# EAGLE schematic all (EAGLE 6.2)
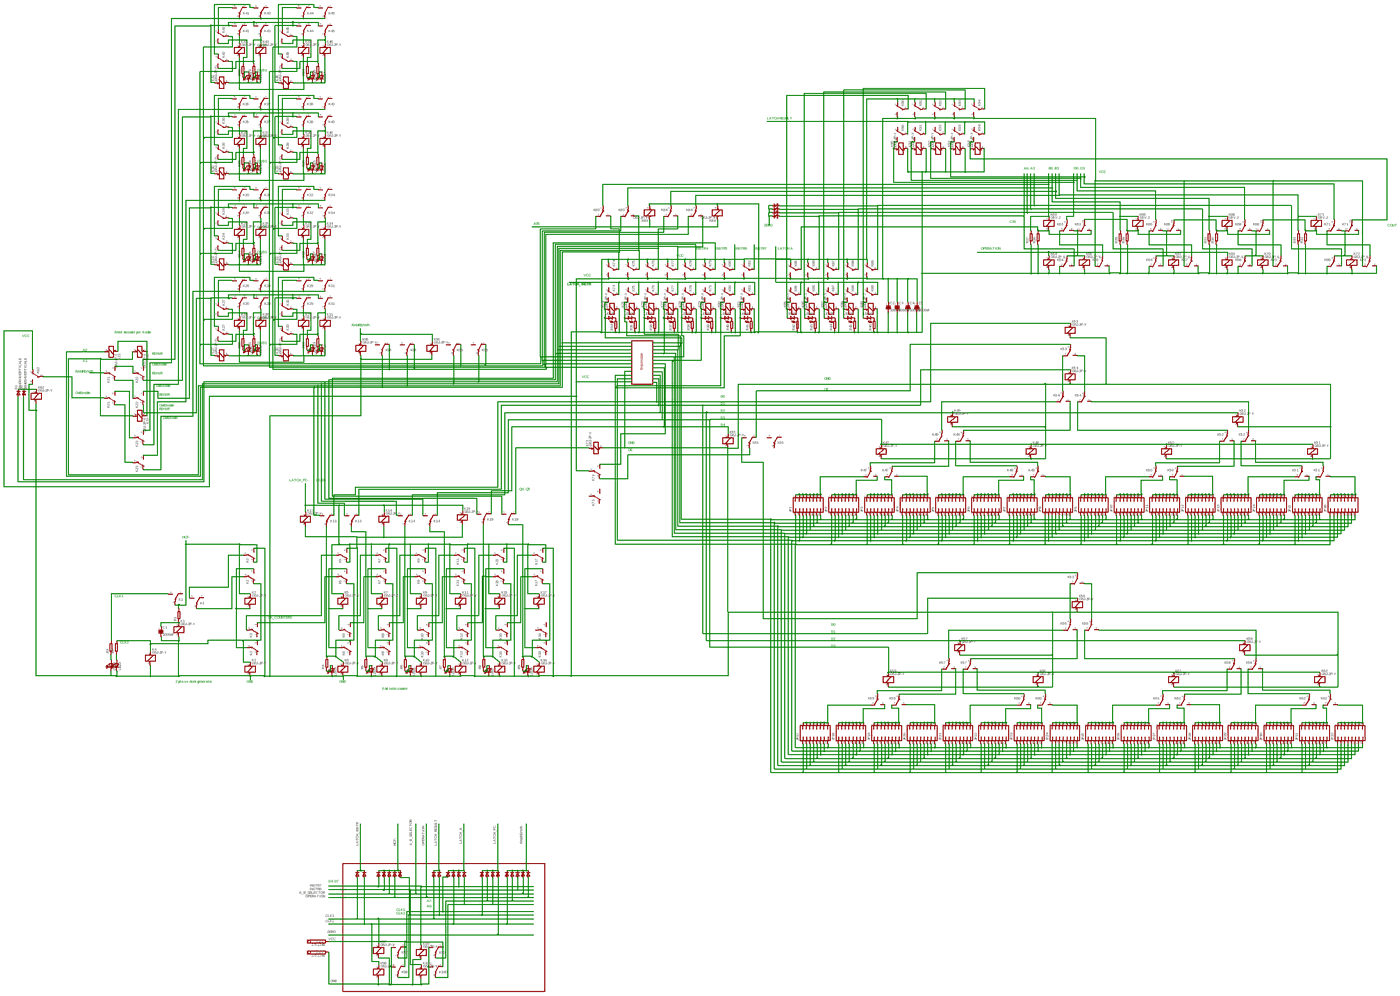
[diagram p0: schematic, sheet 1, overview]
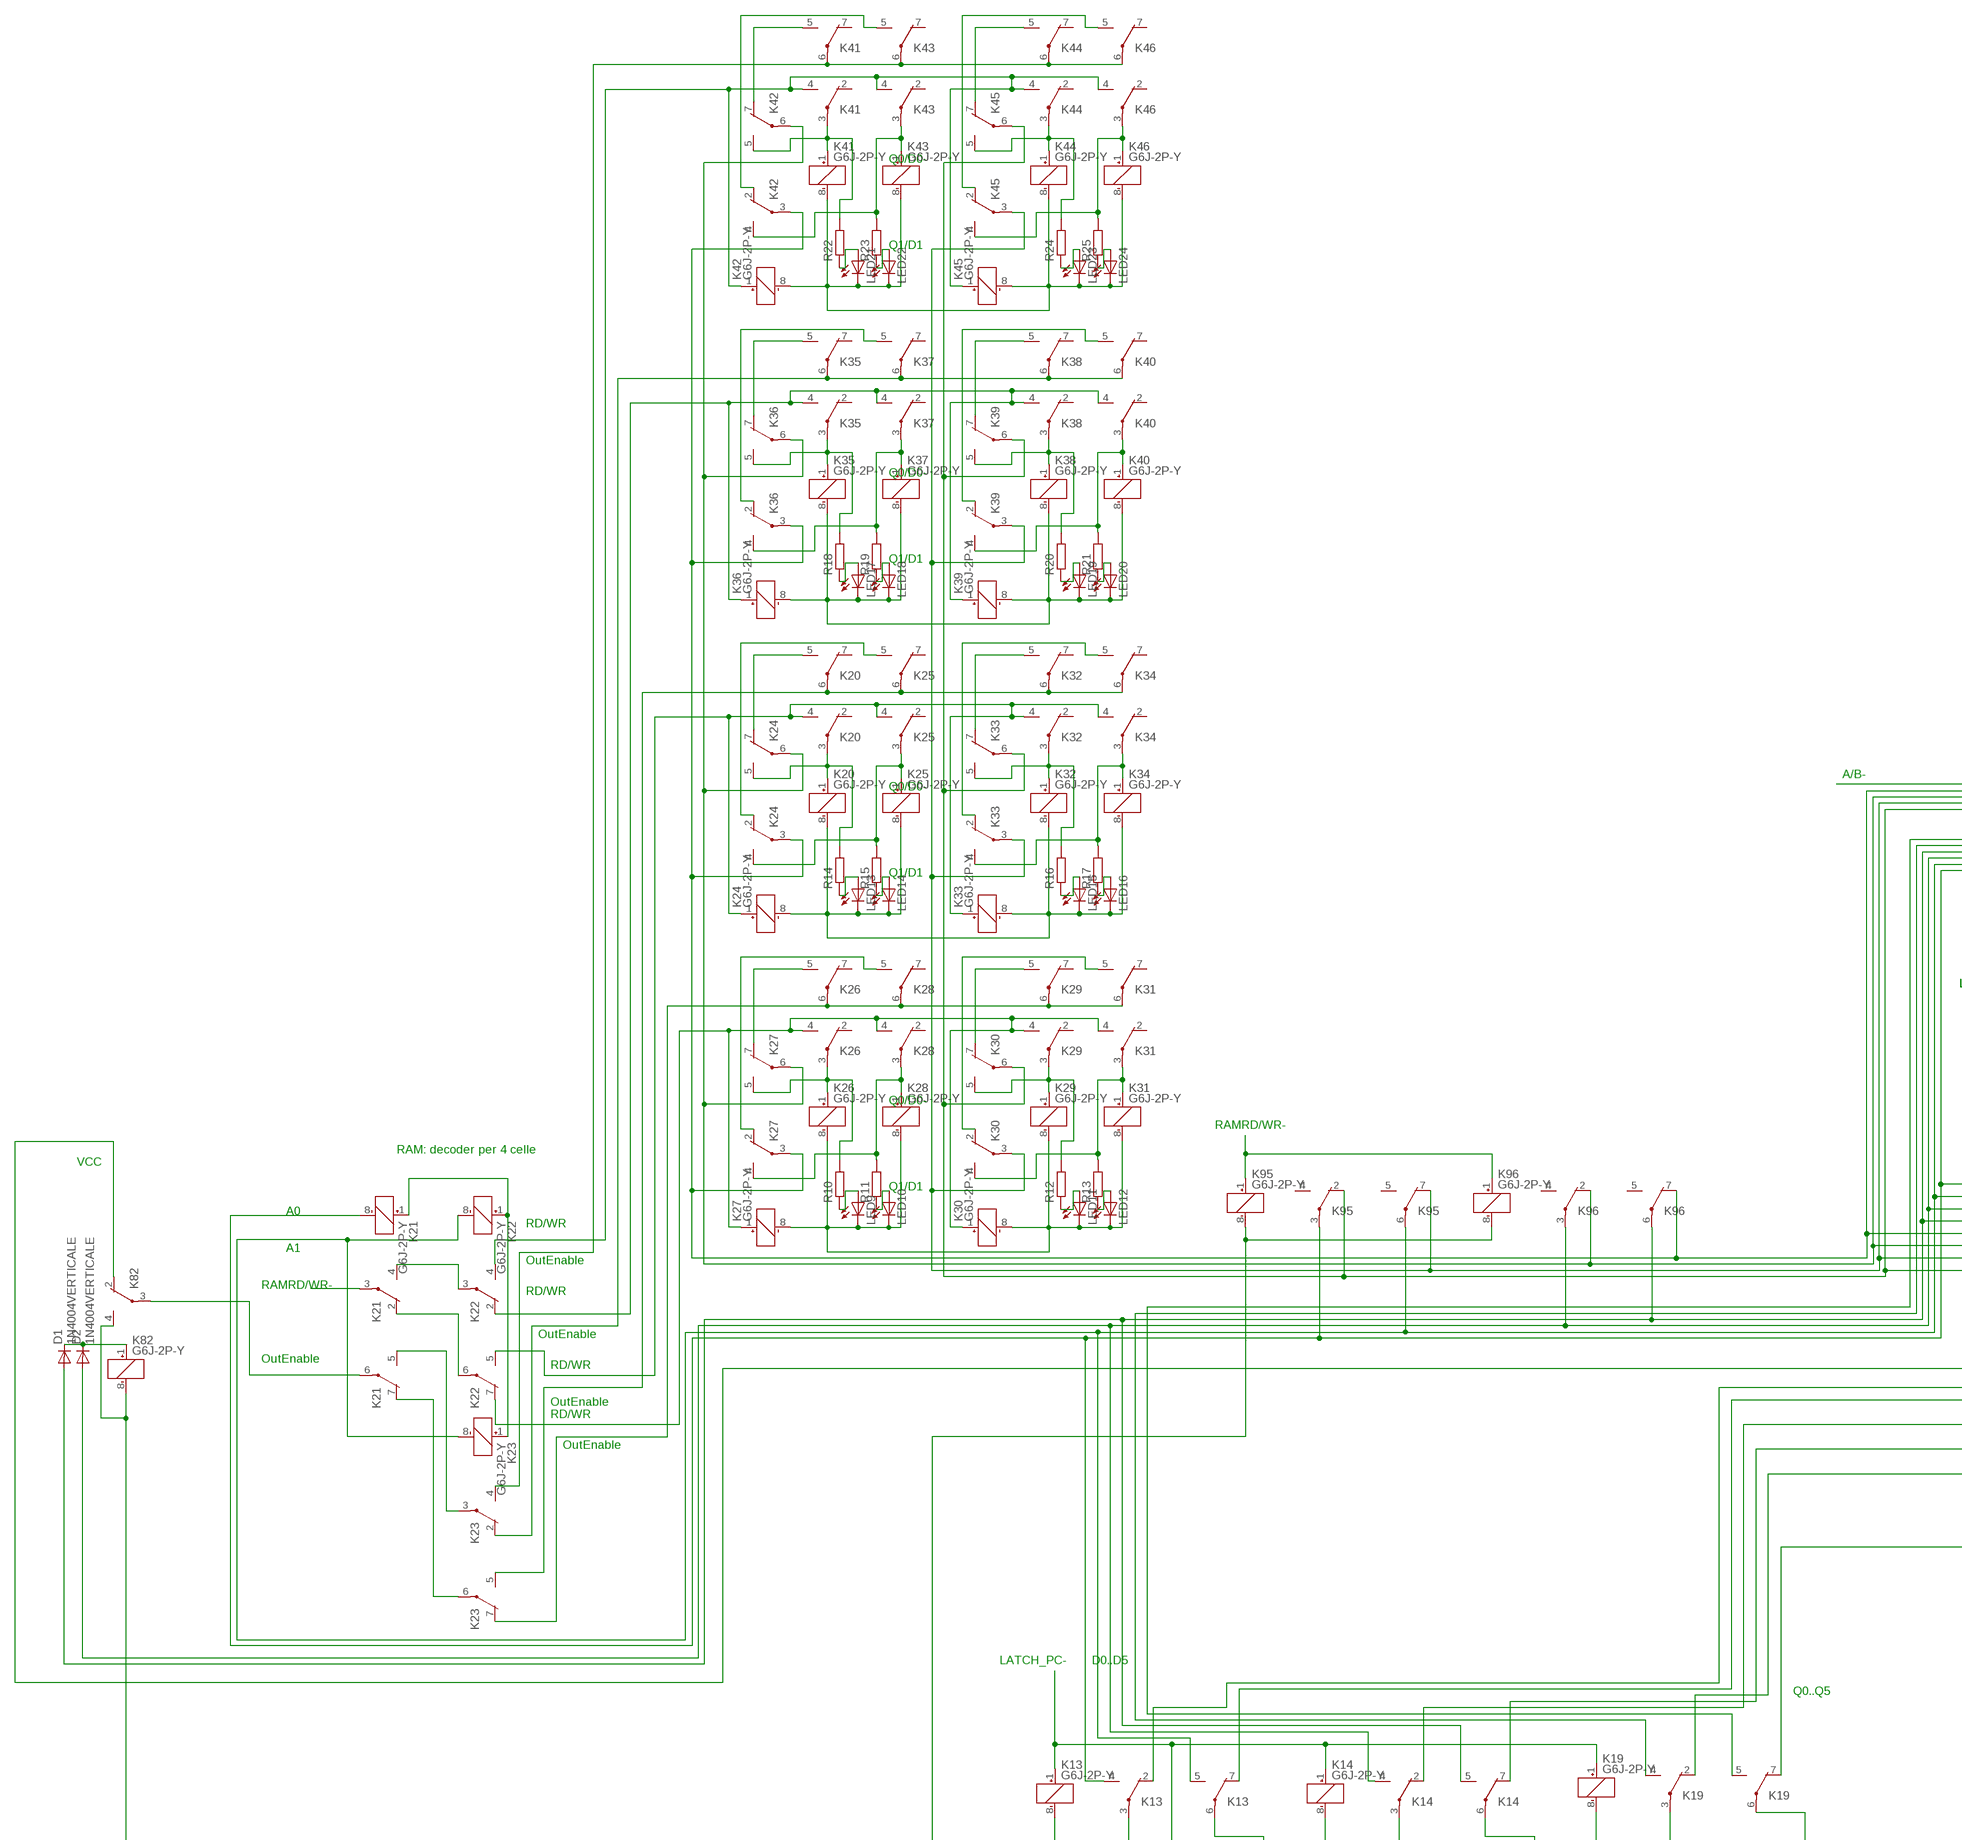
[diagram p1: schematic, sheet 1, part 1 of 5]
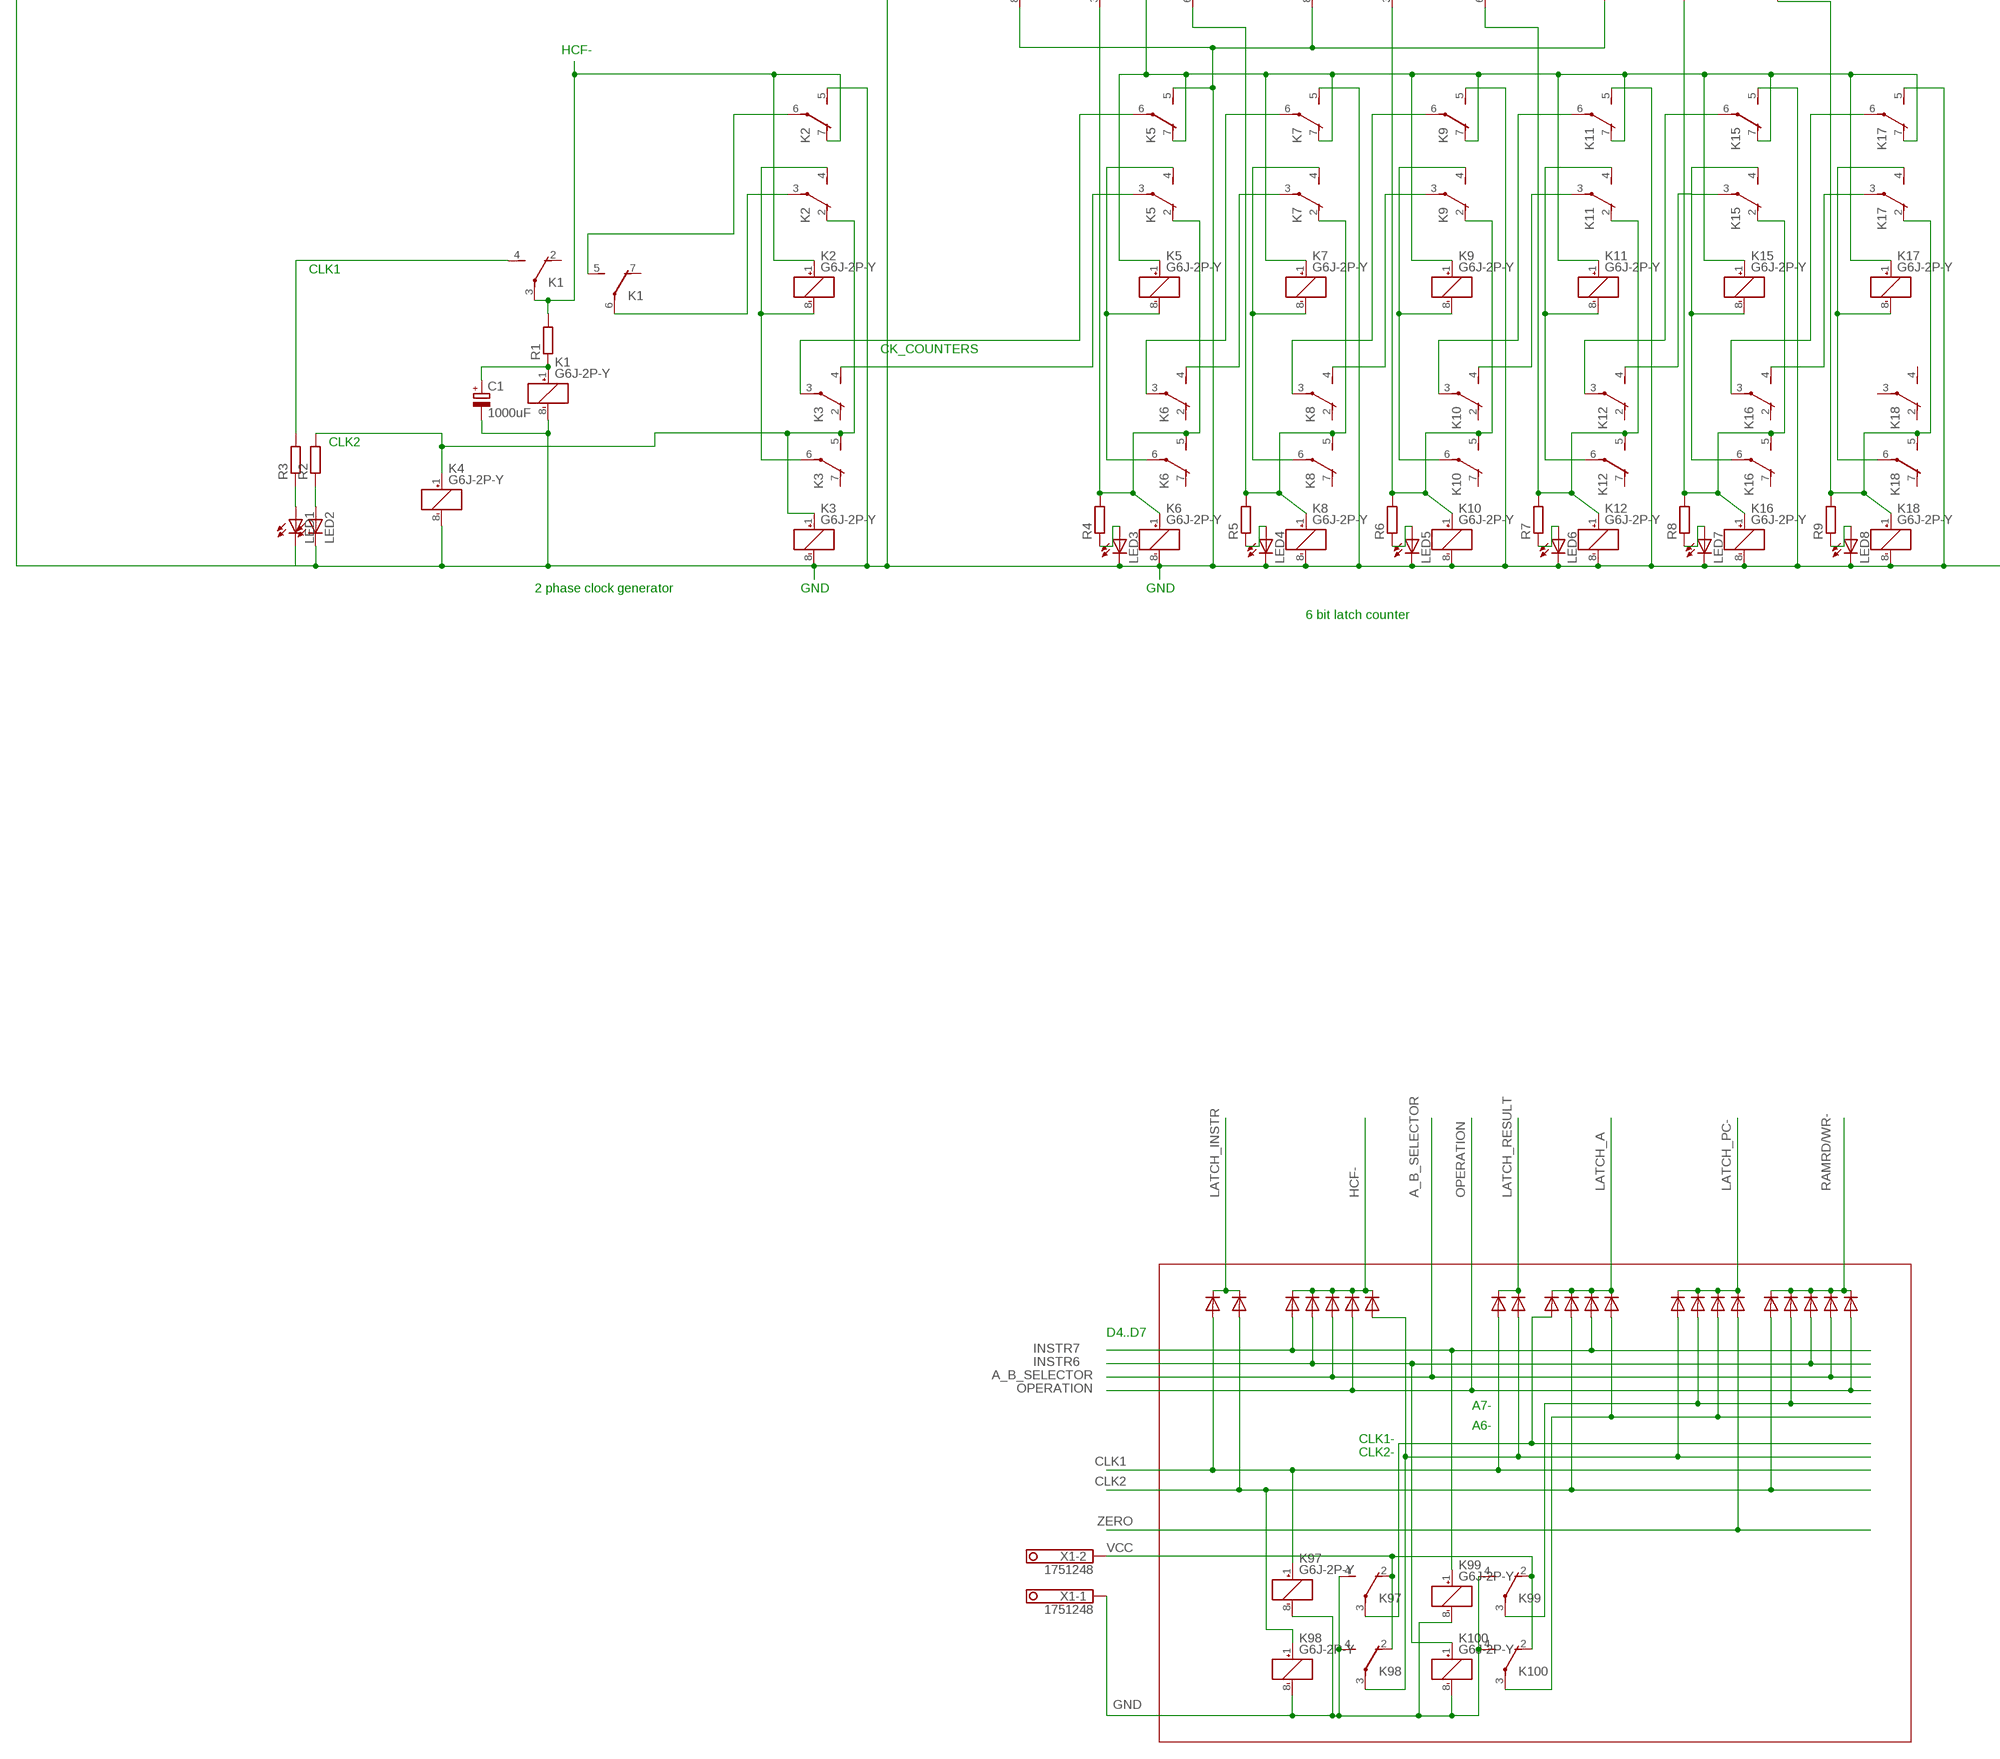
[diagram p2: schematic, sheet 1, part 2 of 5]
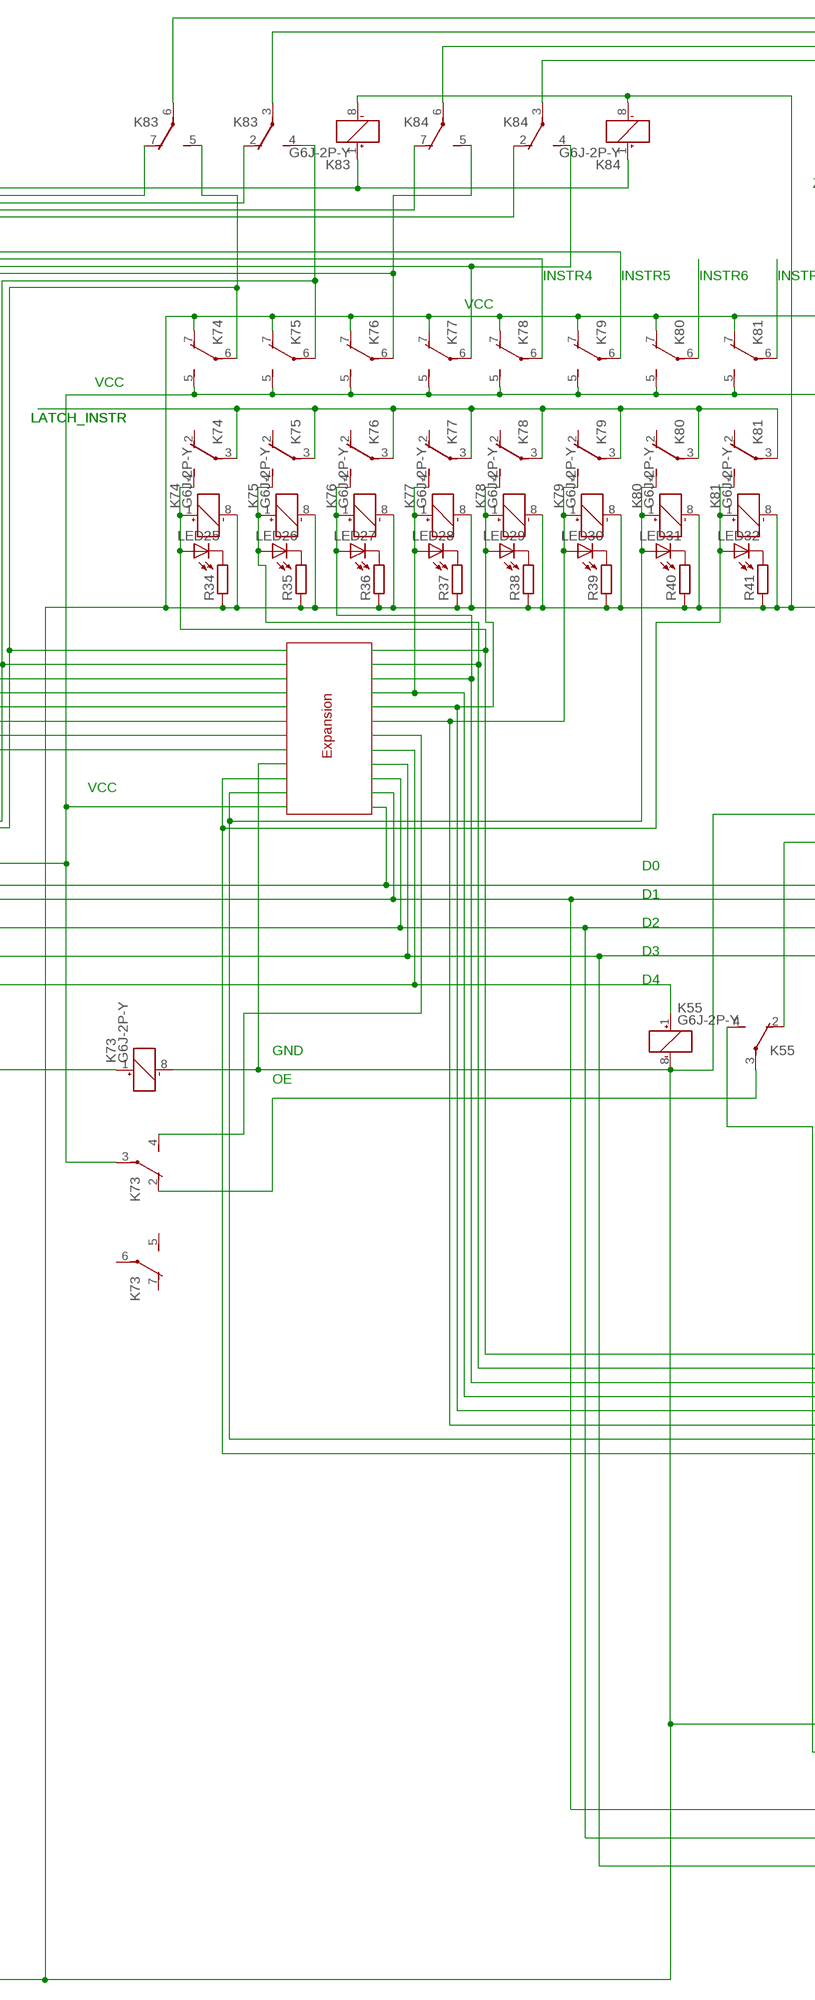
[diagram p3: schematic, sheet 1, part 3 of 5]
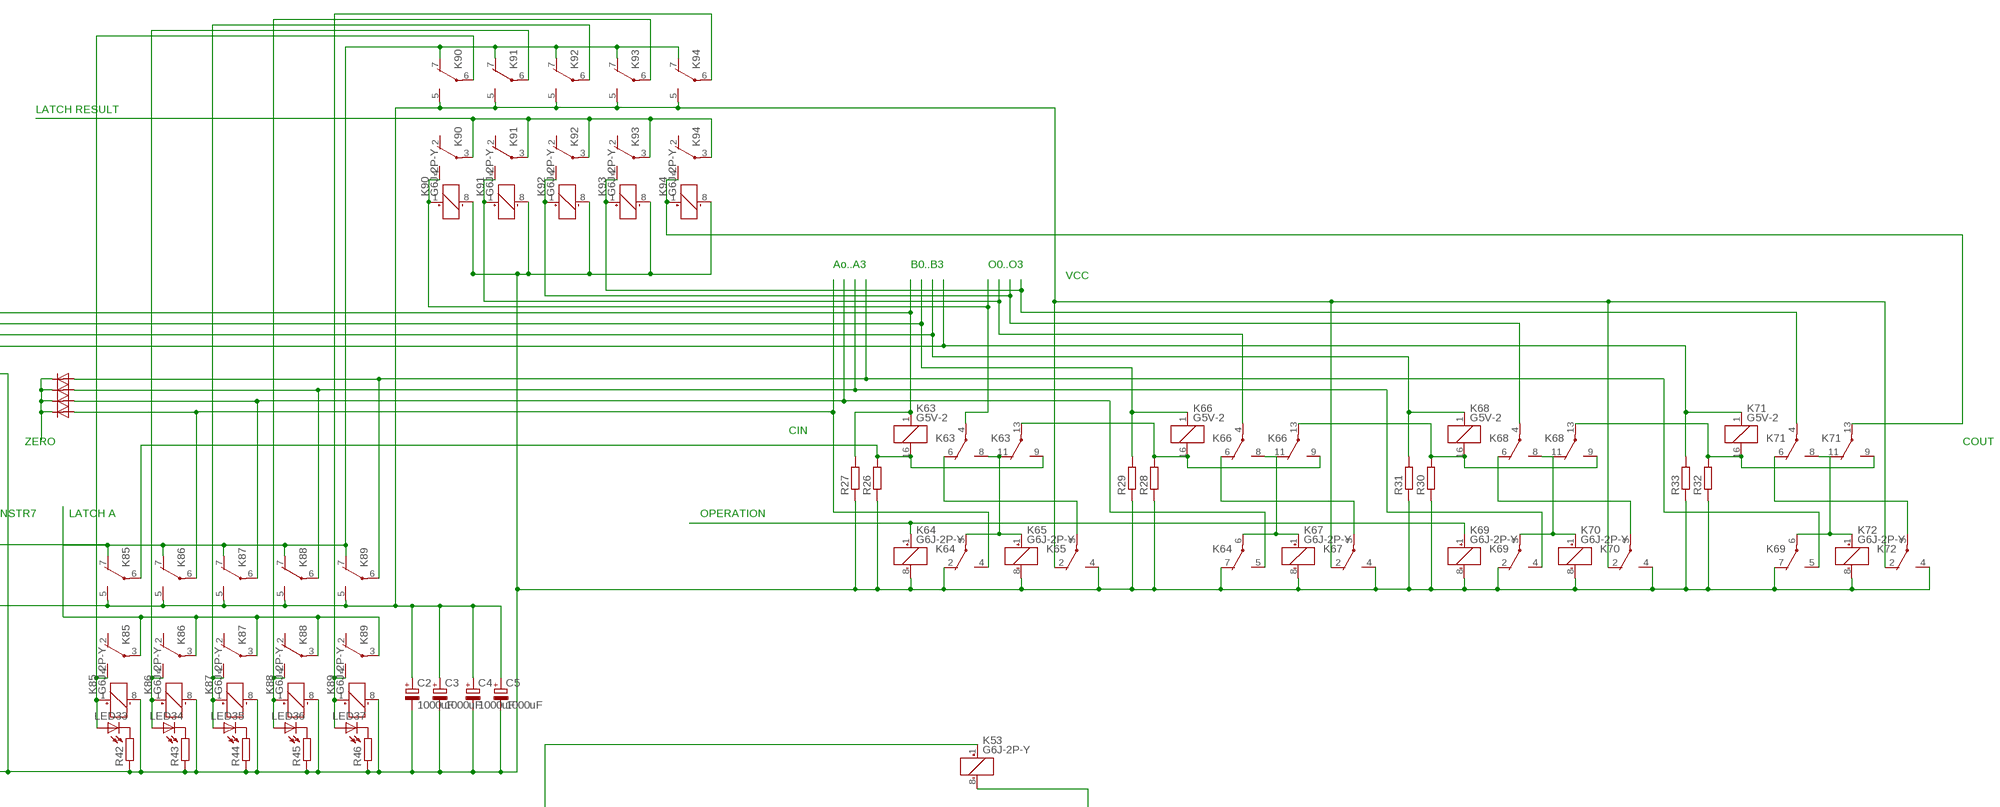
[diagram p4: schematic, sheet 1, part 4 of 5]
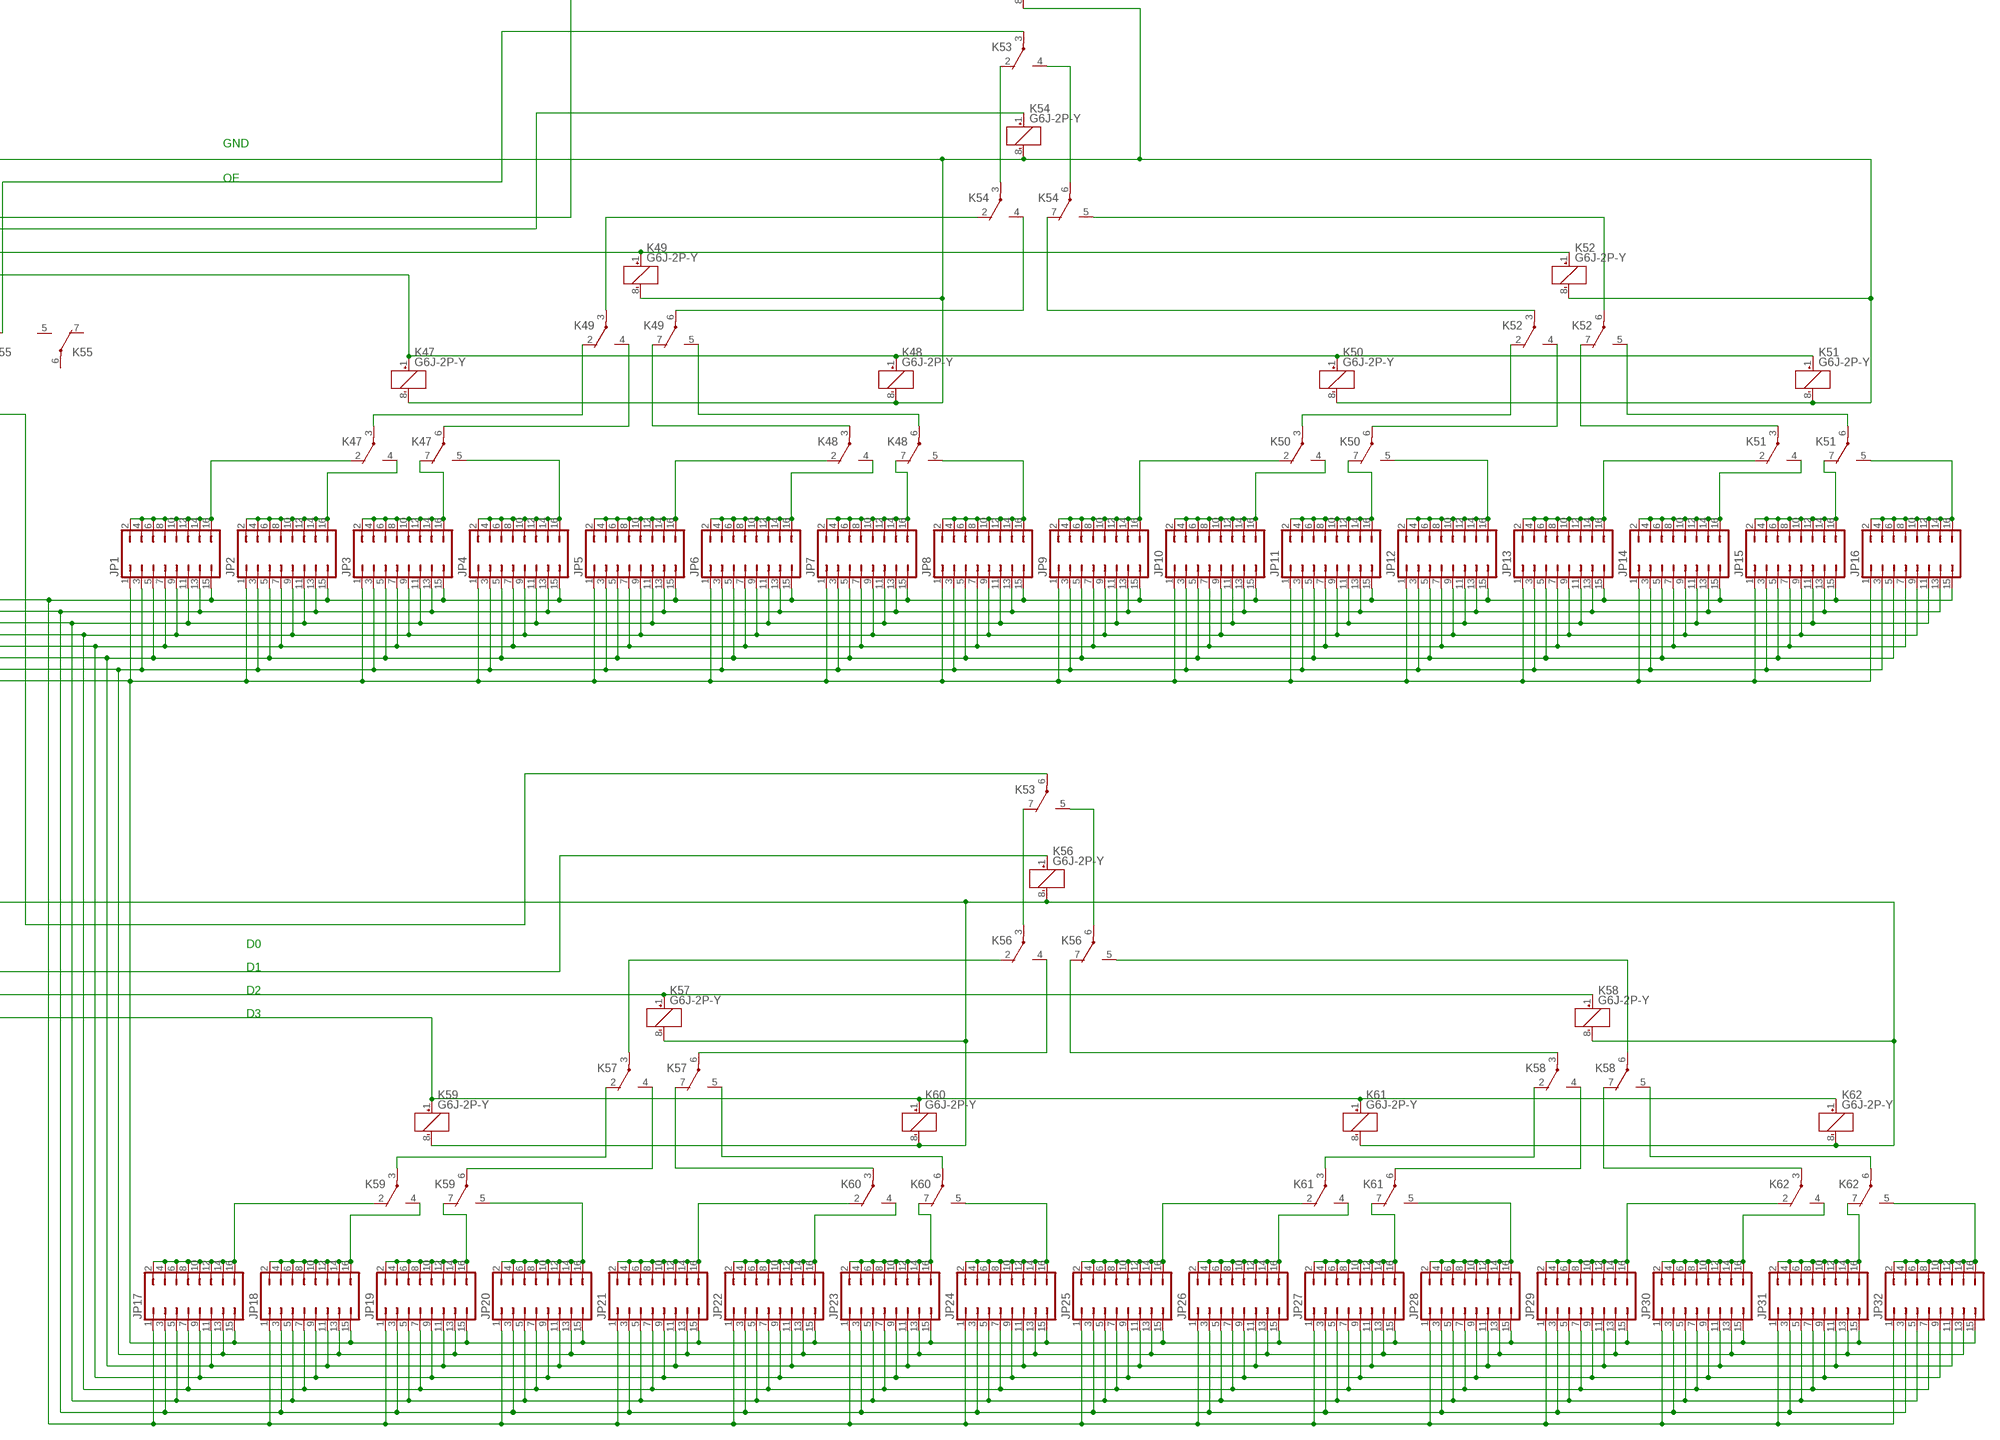
[diagram p5: schematic, sheet 1, part 5 of 5]

## Parts
C1  1000uF  CPOL-EUE5-10.5  [E5-10,5]
C2  1000uF  CPOL-EUE3.5-10  [E3,5-10]
C3  1000uF  CPOL-EUE3.5-10  [E3,5-10]
C4  1000uF  CPOL-EUE3.5-10  [E3,5-10]
C5  1000uF  CPOL-EUE3.5-10  [E3,5-10]
D1  1N4004VERTICALE  [ZDIO-2.5]
D2  1N4004VERTICALE  [ZDIO-2.5]
D3  1N4004VERTICALE  [ZDIO-2.5]
D4  1N4004VERTICALE  [ZDIO-2.5]
D5  1N4004VERTICALE  [ZDIO-2.5]
D6  1N4004VERTICALE  [ZDIO-2.5]
D29  1N4004VERTICALE  [ZDIO-2.5]
D30  1N4004VERTICALE  [ZDIO-2.5]
D31  1N4004VERTICALE  [ZDIO-2.5]
D32  1N4004VERTICALE  [ZDIO-2.5]
D33  1N4004VERTICALE  [ZDIO-2.5]
D34  1N4004VERTICALE  [ZDIO-2.5]
D35  1N4004VERTICALE  [ZDIO-2.5]
D36  1N4004VERTICALE  [ZDIO-2.5]
D37  1N4004VERTICALE  [ZDIO-2.5]
D38  1N4004VERTICALE  [ZDIO-2.5]
D39  1N4004VERTICALE  [ZDIO-2.5]
D40  1N4004VERTICALE  [ZDIO-2.5]
D41  1N4004VERTICALE  [ZDIO-2.5]
D42  1N4004VERTICALE  [ZDIO-2.5]
D43  1N4004VERTICALE  [ZDIO-2.5]
D44  1N4004VERTICALE  [ZDIO-2.5]
D45  1N4004VERTICALE  [ZDIO-2.5]
D46  1N4004VERTICALE  [ZDIO-2.5]
D47  1N4004VERTICALE  [ZDIO-2.5]
D48  1N4004VERTICALE  [ZDIO-2.5]
D49  1N4004VERTICALE  [ZDIO-2.5]
D50  1N4004VERTICALE  [ZDIO-2.5]
JP1  JP8Q  [JP8Q]
JP2  JP8Q  [JP8Q]
JP3  JP8Q  [JP8Q]
JP4  JP8Q  [JP8Q]
JP5  JP8Q  [JP8Q]
JP6  JP8Q  [JP8Q]
JP7  JP8Q  [JP8Q]
JP8  JP8Q  [JP8Q]
JP9  JP8Q  [JP8Q]
JP10  JP8Q  [JP8Q]
JP11  JP8Q  [JP8Q]
JP12  JP8Q  [JP8Q]
JP13  JP8Q  [JP8Q]
JP14  JP8Q  [JP8Q]
JP15  JP8Q  [JP8Q]
JP16  JP8Q  [JP8Q]
JP17  JP8Q  [JP8Q]
JP18  JP8Q  [JP8Q]
JP19  JP8Q  [JP8Q]
JP20  JP8Q  [JP8Q]
JP21  JP8Q  [JP8Q]
JP22  JP8Q  [JP8Q]
JP23  JP8Q  [JP8Q]
JP24  JP8Q  [JP8Q]
JP25  JP8Q  [JP8Q]
JP26  JP8Q  [JP8Q]
JP27  JP8Q  [JP8Q]
JP28  JP8Q  [JP8Q]
JP29  JP8Q  [JP8Q]
JP30  JP8Q  [JP8Q]
JP31  JP8Q  [JP8Q]
JP32  JP8Q  [JP8Q]
K1  G6J-2P-Y  [G6J-2P-Y]
K2  G6J-2P-Y  [G6J-2P-Y]
K3  G6J-2P-Y  [G6J-2P-Y]
K4  G6J-2P-Y  [G6J-2P-Y]
K5  G6J-2P-Y  [G6J-2P-Y]
K6  G6J-2P-Y  [G6J-2P-Y]
K7  G6J-2P-Y  [G6J-2P-Y]
K8  G6J-2P-Y  [G6J-2P-Y]
K9  G6J-2P-Y  [G6J-2P-Y]
K10  G6J-2P-Y  [G6J-2P-Y]
K11  G6J-2P-Y  [G6J-2P-Y]
K12  G6J-2P-Y  [G6J-2P-Y]
K13  G6J-2P-Y  [G6J-2P-Y]
K14  G6J-2P-Y  [G6J-2P-Y]
K15  G6J-2P-Y  [G6J-2P-Y]
K16  G6J-2P-Y  [G6J-2P-Y]
K17  G6J-2P-Y  [G6J-2P-Y]
K18  G6J-2P-Y  [G6J-2P-Y]
K19  G6J-2P-Y  [G6J-2P-Y]
K20  G6J-2P-Y  [G6J-2P-Y]
K21  G6J-2P-Y  [G6J-2P-Y]
K22  G6J-2P-Y  [G6J-2P-Y]
K23  G6J-2P-Y  [G6J-2P-Y]
K24  G6J-2P-Y  [G6J-2P-Y]
K25  G6J-2P-Y  [G6J-2P-Y]
K26  G6J-2P-Y  [G6J-2P-Y]
K27  G6J-2P-Y  [G6J-2P-Y]
K28  G6J-2P-Y  [G6J-2P-Y]
K29  G6J-2P-Y  [G6J-2P-Y]
K30  G6J-2P-Y  [G6J-2P-Y]
K31  G6J-2P-Y  [G6J-2P-Y]
K32  G6J-2P-Y  [G6J-2P-Y]
K33  G6J-2P-Y  [G6J-2P-Y]
K34  G6J-2P-Y  [G6J-2P-Y]
K35  G6J-2P-Y  [G6J-2P-Y]
K36  G6J-2P-Y  [G6J-2P-Y]
K37  G6J-2P-Y  [G6J-2P-Y]
K38  G6J-2P-Y  [G6J-2P-Y]
K39  G6J-2P-Y  [G6J-2P-Y]
K40  G6J-2P-Y  [G6J-2P-Y]
K41  G6J-2P-Y  [G6J-2P-Y]
K42  G6J-2P-Y  [G6J-2P-Y]
K43  G6J-2P-Y  [G6J-2P-Y]
K44  G6J-2P-Y  [G6J-2P-Y]
K45  G6J-2P-Y  [G6J-2P-Y]
K46  G6J-2P-Y  [G6J-2P-Y]
K47  G6J-2P-Y  [G6J-2P-Y]
K48  G6J-2P-Y  [G6J-2P-Y]
K49  G6J-2P-Y  [G6J-2P-Y]
K50  G6J-2P-Y  [G6J-2P-Y]
K51  G6J-2P-Y  [G6J-2P-Y]
K52  G6J-2P-Y  [G6J-2P-Y]
K53  G6J-2P-Y  [G6J-2P-Y]
K54  G6J-2P-Y  [G6J-2P-Y]
K55  G6J-2P-Y  [G6J-2P-Y]
K56  G6J-2P-Y  [G6J-2P-Y]
K57  G6J-2P-Y  [G6J-2P-Y]
K58  G6J-2P-Y  [G6J-2P-Y]
K59  G6J-2P-Y  [G6J-2P-Y]
K60  G6J-2P-Y  [G6J-2P-Y]
K61  G6J-2P-Y  [G6J-2P-Y]
K62  G6J-2P-Y  [G6J-2P-Y]
K63  G5V-2  [G5V-2]
K64  G6J-2P-Y  [G6J-2P-Y]
K65  G6J-2P-Y  [G6J-2P-Y]
K66  G5V-2  [G5V-2]
K67  G6J-2P-Y  [G6J-2P-Y]
K68  G5V-2  [G5V-2]
K69  G6J-2P-Y  [G6J-2P-Y]
K70  G6J-2P-Y  [G6J-2P-Y]
K71  G5V-2  [G5V-2]
K72  G6J-2P-Y  [G6J-2P-Y]
K73  G6J-2P-Y  [G6J-2P-Y]
K74  G6J-2P-Y  [G6J-2P-Y]
K75  G6J-2P-Y  [G6J-2P-Y]
K76  G6J-2P-Y  [G6J-2P-Y]
K77  G6J-2P-Y  [G6J-2P-Y]
K78  G6J-2P-Y  [G6J-2P-Y]
K79  G6J-2P-Y  [G6J-2P-Y]
K80  G6J-2P-Y  [G6J-2P-Y]
K81  G6J-2P-Y  [G6J-2P-Y]
K82  G6J-2P-Y  [G6J-2P-Y]
K83  G6J-2P-Y  [G6J-2P-Y]
K84  G6J-2P-Y  [G6J-2P-Y]
K85  G6J-2P-Y  [G6J-2P-Y]
K86  G6J-2P-Y  [G6J-2P-Y]
K87  G6J-2P-Y  [G6J-2P-Y]
K88  G6J-2P-Y  [G6J-2P-Y]
K89  G6J-2P-Y  [G6J-2P-Y]
K90  G6J-2P-Y  [G6J-2P-Y]
K91  G6J-2P-Y  [G6J-2P-Y]
K92  G6J-2P-Y  [G6J-2P-Y]
K93  G6J-2P-Y  [G6J-2P-Y]
K94  G6J-2P-Y  [G6J-2P-Y]
K95  G6J-2P-Y  [G6J-2P-Y]
K96  G6J-2P-Y  [G6J-2P-Y]
K97  G6J-2P-Y  [G6J-2P-Y]
K98  G6J-2P-Y  [G6J-2P-Y]
K99  G6J-2P-Y  [G6J-2P-Y]
K100  G6J-2P-Y  [G6J-2P-Y]
LED1  LED5MM  [LED5MM]
LED2  LED5MM  [LED5MM]
LED3  LED5MM  [LED5MM]
LED4  LED5MM  [LED5MM]
LED5  LED5MM  [LED5MM]
LED6  LED5MM  [LED5MM]
LED7  LED5MM  [LED5MM]
LED8  LED5MM  [LED5MM]
LED9  LED5MM  [LED5MM]
LED10  LED5MM  [LED5MM]
LED11  LED5MM  [LED5MM]
LED12  LED5MM  [LED5MM]
LED13  LED5MM  [LED5MM]
LED14  LED5MM  [LED5MM]
LED15  LED5MM  [LED5MM]
LED16  LED5MM  [LED5MM]
LED17  LED5MM  [LED5MM]
LED18  LED5MM  [LED5MM]
LED19  LED5MM  [LED5MM]
LED20  LED5MM  [LED5MM]
LED21  LED5MM  [LED5MM]
LED22  LED5MM  [LED5MM]
LED23  LED5MM  [LED5MM]
LED24  LED5MM  [LED5MM]
LED25  LED3MM  [LED3MM]
LED26  LED3MM  [LED3MM]
LED27  LED3MM  [LED3MM]
LED28  LED3MM  [LED3MM]
LED29  LED3MM  [LED3MM]
LED30  LED3MM  [LED3MM]
LED31  LED3MM  [LED3MM]
LED32  LED3MM  [LED3MM]
LED33  LED3MM  [LED3MM]
LED34  LED3MM  [LED3MM]
LED35  LED3MM  [LED3MM]
LED36  LED3MM  [LED3MM]
LED37  LED3MM  [LED3MM]
R1  R-EU_0204/2V  [0204V]
R2  R-EU_0204/2V  [0204V]
R3  R-EU_0204/2V  [0204V]
R4  R-EU_0204/2V  [0204V]
R5  R-EU_0204/2V  [0204V]
R6  R-EU_0204/2V  [0204V]
R7  R-EU_0204/2V  [0204V]
R8  R-EU_0204/2V  [0204V]
R9  R-EU_0204/2V  [0204V]
R10  R-EU_0204/2V  [0204V]
R11  R-EU_0204/2V  [0204V]
R12  R-EU_0204/2V  [0204V]
R13  R-EU_0204/2V  [0204V]
R14  R-EU_0204/2V  [0204V]
R15  R-EU_0204/2V  [0204V]
R16  R-EU_0204/2V  [0204V]
R17  R-EU_0204/2V  [0204V]
R18  R-EU_0204/2V  [0204V]
R19  R-EU_0204/2V  [0204V]
R20  R-EU_0204/2V  [0204V]
R21  R-EU_0204/2V  [0204V]
R22  R-EU_0204/2V  [0204V]
R23  R-EU_0204/2V  [0204V]
R24  R-EU_0204/2V  [0204V]
R25  R-EU_0204/2V  [0204V]
R26  R-EU_0204/2V  [0204V]
R27  R-EU_0204/2V  [0204V]
R28  R-EU_0204/2V  [0204V]
R29  R-EU_0204/2V  [0204V]
R30  R-EU_0204/2V  [0204V]
R31  R-EU_0204/2V  [0204V]
R32  R-EU_0204/2V  [0204V]
R33  R-EU_0204/2V  [0204V]
R34  R-EU_0204/2V  [0204V]
R35  R-EU_0204/2V  [0204V]
R36  R-EU_0204/2V  [0204V]
R37  R-EU_0204/2V  [0204V]
R38  R-EU_0204/2V  [0204V]
R39  R-EU_0204/2V  [0204V]
R40  R-EU_0204/2V  [0204V]
R41  R-EU_0204/2V  [0204V]
R42  R-EU_0204/2V  [0204V]
R43  R-EU_0204/2V  [0204V]
R44  R-EU_0204/2V  [0204V]
R45  R-EU_0204/2V  [0204V]
R46  R-EU_0204/2V  [0204V]
X1  1751248  [1751248]

## Nets
A_B_SELECTOR: D33.A D49.A K83.1(1:+) K84.1(1:+)
CLK1: D29.A D36.A K1.4(2:S) K97.1(1:+) R3.2
CLK2: D30.A D39.A D46.A K2.2(2:O) K3.1(1:+) K3.5(3:S) K4.1(1:+) K98.1(1:+) R2.2
GND: C1.- C2.- C3.- C4.- C5.- K1.8(1:-) K2.5(3:S) K3.8(1:-) K4.8(1:-) K5.5(3:S) K6.8(1:-) K7.5(3:S) K8.8(1:-) K9.5(3:S) K10.8(1:-) K11.5(3:S) K12.8(1:-) K13.8(1:-) K14.8(1:-) K15.5(3:S) K16.8(1:-) K17.5(3:S) K18.8(1:-) K19.8(1:-) K47.8(1:-) K48.8(1:-) K49.8(1:-) K50.8(1:-) K51.8(1:-) K52.8(1:-) K53.8(1:-) K54.8(1:-) K55.8(1:-) K56.8(1:-) K57.8(1:-) K58.8(1:-) K59.8(1:-) K60.8(1:-) K61.8(1:-) K62.8(1:-) K64.2(2:O) K64.7(3:O) K64.8(1:-) K65.4(2:S) K65.8(1:-) K67.4(2:S) K67.8(1:-) K69.2(2:O) K69.7(3:O) K69.8(1:-) K70.4(2:S) K70.8(1:-) K72.4(2:S) K72.8(1:-) K73.8(1:-) K74.7(3:O) K74.8(1:-) K75.7(3:O) K75.8(1:-) K76.7(3:O) K76.8(1:-) K77.7(3:O) K77.8(1:-) K78.7(3:O) K78.8(1:-) K79.7(3:O) K79.8(1:-) K80.7(3:O) K80.8(1:-) K81.7(3:O) K81.8(1:-) K82.4(2:S) K82.8(1:-) K83.8(1:-) K84.8(1:-) K85.7(3:O) K85.8(1:-) K86.7(3:O) K86.8(1:-) K87.7(3:O) K87.8(1:-) K88.7(3:O) K88.8(1:-) K89.7(3:O) K89.8(1:-) K90.7(3:O) K90.8(1:-) K91.7(3:O) K91.8(1:-) K92.7(3:O) K92.8(1:-) K93.7(3:O) K93.8(1:-) K94.7(3:O) K94.8(1:-) K95.8(1:-) K96.8(1:-) K97.4(2:S) K97.8(1:-) K98.4(2:S) K98.8(1:-) K99.4(2:S) K99.8(1:-) K100.4(2:S) K100.8(1:-) LED1.K(C) LED2.K(C) LED3.K(C) LED4.K(C) LED5.K(C) LED6.K(C) LED7.K(C) LED8.K(C) R26.1 R27.1 R28.1 R29.1 R30.1 R31.1 R32.1 R33.1 R34.1 R35.1 R36.1 R37.1 R38.1 R39.1 R40.1 R41.1 R42.1 R43.1 R44.1 R45.1 R46.1 X1.1
HCF-: D31.C D32.C D33.C D34.C D35.C K1.3(2:P) K2.1(1:+) K2.7(3:O) R1.2
INSTR4: K19.4(2:S) K78.6(3:P)
INSTR5: K19.5(3:S) K79.6(3:P)
INSTR6: D32.A D48.A K80.6(3:P) K100.1(1:+)
INSTR7: D31.A D40.A K81.6(3:P) K99.1(1:+)
LATCH_A: D38.C D39.C D40.C D41.C K85.3(2:P) K86.3(2:P) K87.3(2:P) K88.3(2:P) K89.3(2:P)
LATCH_INSTR: D29.C D30.C K74.3(2:P) K75.3(2:P) K76.3(2:P) K77.3(2:P) K78.3(2:P) K79.3(2:P) K80.3(2:P) K81.3(2:P)
LATCH_PC-: D42.C D43.C D44.C D45.C K5.1(1:+) K5.7(3:O) K7.1(1:+) K7.7(3:O) K9.1(1:+) K9.7(3:O) K11.1(1:+) K11.7(3:O) K13.1(1:+) K14.1(1:+) K15.1(1:+) K15.7(3:O) K17.1(1:+) K17.7(3:O) K19.1(1:+)
LATCH_RESULT: D36.C D37.C K90.3(2:P) K91.3(2:P) K92.3(2:P) K93.3(2:P) K94.3(2:P)
N$1: C1.+ K1.1(1:+) R1.1
N$2: K6.3(2:P) K7.6(3:P)
N$3: K6.4(2:S) K7.3(2:P)
N$5: K1.5(3:S) K2.6(3:P)
N$6: K1.6(3:P) K2.3(2:P)
N$7: D38.A K97.3(2:P)
N$8: K63.9(2:S) K63.16 K85.6(3:P) R26.2
N$9: D35.A D37.A D42.A K98.3(2:P)
N$10: K2.4(2:S) K2.8(1:-) K3.6(3:P)
N$11: K3.4(2:S) K5.3(2:P)
N$12: K3.3(2:P) K5.6(3:P)
N$13: K13.4(2:S) K21.8(1:-) K74.6(3:P) K83.5(3:S) K95.3(2:P)
N$14: K19.2(2:O) K55.1(1:+)
N$15: K12.3(2:P) K15.6(3:P)
N$16: K13.7(3:O) K54.1(1:+) K56.1(1:+)
N$17: K12.4(2:S) K15.3(2:P)
N$18: K5.2(2:O) K6.1(1:+) K6.5(3:S) K13.3(2:P) R4.2
N$19: K5.4(2:S) K5.8(1:-) K6.6(3:P)
N$20: K13.5(3:S) K22.8(1:-) K23.8(1:-) K75.6(3:P) K83.4(2:S) K95.6(3:P)
N$21: K13.2(2:O) K53.1(1:+)
N$22: D2.A K14.4(2:S) K76.6(3:P) K84.5(3:S) K96.3(2:P)
N$23: K7.2(2:O) K8.1(1:+) K8.5(3:S) K13.6(3:P) R5.2
N$24: K7.4(2:S) K7.8(1:-) K8.6(3:P)
N$25: D1.A K14.5(3:S) K77.6(3:P) K84.4(2:S) K96.6(3:P)
N$26: K14.2(2:O) K49.1(1:+) K52.1(1:+) K57.1(1:+) K58.1(1:+)
N$27: K8.3(2:P) K9.6(3:P)
N$28: K8.4(2:S) K9.3(2:P)
N$29: K14.7(3:O) K47.1(1:+) K48.1(1:+) K50.1(1:+) K51.1(1:+) K59.1(1:+) K60.1(1:+) K61.1(1:+) K62.1(1:+)
N$30: K15.2(2:O) K16.1(1:+) K16.5(3:S) K19.3(2:P) R8.2
N$31: K9.2(2:O) K10.1(1:+) K10.5(3:S) K14.3(2:P) R6.2
N$32: K9.4(2:S) K9.8(1:-) K10.6(3:P)
N$33: K15.4(2:S) K15.8(1:-) K16.6(3:P)
N$34: K16.3(2:P) K17.6(3:P)
N$35: K10.3(2:P) K11.6(3:P)
N$36: K10.4(2:S) K11.3(2:P)
N$38: K16.4(2:S) K17.3(2:P)
N$39: K11.2(2:O) K12.1(1:+) K12.5(3:S) K14.6(3:P) R7.2
N$40: K11.4(2:S) K11.8(1:-) K12.6(3:P)
N$41: K19.7(3:O) K73.1(1:+)
N$42: LED1.A R3.1
N$43: LED2.A R2.1
N$44: K17.2(2:O) K18.1(1:+) K18.5(3:S) K19.6(3:P) R9.2
N$45: K17.4(2:S) K17.8(1:-) K18.6(3:P)
N$50: LED9.A R10.1
N$51: D43.A D47.A K99.3(2:P)
N$52: D41.A D44.A K100.3(2:P)
N$53: LED3.A R4.1
N$54: LED4.A R5.1
N$55: LED5.A R6.1
N$56: LED6.A R7.1
N$57: LED7.A R8.1
N$58: LED8.A R9.1
N$59: LED10.A R11.1
N$60: LED11.A R12.1
N$61: LED12.A R13.1
N$62: K21.4(2:S) K22.3(2:P)
N$63: K21.2(2:O) K22.6(3:P)
N$64: K86.1(1:+) K86.4(2:S) K91.6(3:P) LED34.A
N$65: K22.2(2:O) K35.4(2:S) K36.1(1:+) K37.4(2:S) K38.4(2:S) K39.1(1:+) K40.4(2:S)
N$66: K20.4(2:S) K22.5(3:S) K24.1(1:+) K25.4(2:S) K32.4(2:S) K33.1(1:+) K34.4(2:S)
N$67: K22.7(3:O) K26.4(2:S) K27.1(1:+) K28.4(2:S) K29.4(2:S) K30.1(1:+) K31.4(2:S)
N$68: K21.5(3:S) K23.3(2:P)
N$69: K21.7(3:O) K23.6(3:P)
N$70: K63.1 K83.6(3:P) R27.2
N$71: K23.2(2:O) K35.6(3:P) K37.6(3:P) K38.6(3:P) K40.6(3:P)
N$72: D6.A K64.4(2:S) K86.6(3:P)
N$73: K23.7(3:O) K26.6(3:P) K28.6(3:P) K29.6(3:P) K31.6(3:P)
N$75: K21.6(3:P) K82.3(2:P)
N$78: K21.1(1:+) K22.1(1:+) K23.1(1:+)
N$79: K22.4(2:S) K41.4(2:S) K42.1(1:+) K43.4(2:S) K44.4(2:S) K45.1(1:+) K46.4(2:S)
N$80: K23.4(2:S) K41.6(3:P) K43.6(3:P) K44.6(3:P) K46.6(3:P)
N$81: JP1.2 JP1.4 JP1.6 JP1.8 JP1.10 JP1.12 JP1.14 JP1.16 K47.2(2:O)
N$82: K20.6(3:P) K23.5(3:S) K25.6(3:P) K32.6(3:P) K34.6(3:P)
N$83: K20.1(1:+) K20.3(2:P) K24.5(3:S) R14.2
N$84: K26.1(1:+) K26.3(2:P) K27.5(3:S) R10.2
N$85: K24.2(2:O) K25.5(3:S)
N$86: K24.4(2:S) K25.1(1:+) K25.3(2:P) R15.2
N$87: K20.5(3:S) K24.7(3:O)
N$88: K27.2(2:O) K28.5(3:S)
N$89: K27.4(2:S) K28.1(1:+) K28.3(2:P) R11.2
N$90: K26.5(3:S) K27.7(3:O)
N$91: K24.6(3:P) K27.6(3:P) K36.6(3:P) K42.6(3:P) K83.2(2:O) K96.2(2:O)
N$92: K24.3(2:P) K27.3(2:P) K36.3(2:P) K42.3(2:P) K83.7(3:O) K96.7(3:O)
N$93: K29.1(1:+) K29.3(2:P) K30.5(3:S) R12.2
N$94: K26.8(1:-) K27.8(1:-) K28.8(1:-) K29.8(1:-) K30.8(1:-) K31.8(1:-) LED9.K(C) LED10.K(C) LED11.K(C) LED12.K(C)
N$95: JP2.2 JP2.4 JP2.6 JP2.8 JP2.10 JP2.12 JP2.14 JP2.16 K47.4(2:S)
N$96: JP3.2 JP3.4 JP3.6 JP3.8 JP3.10 JP3.12 JP3.14 JP3.16 K47.7(3:O)
N$97: K30.2(2:O) K31.5(3:S)
N$98: K30.4(2:S) K31.1(1:+) K31.3(2:P) R13.2
N$99: K29.5(3:S) K30.7(3:O)
N$100: K30.6(3:P) K33.6(3:P) K39.6(3:P) K45.6(3:P) K84.2(2:O) K95.2(2:O)
N$101: K30.3(2:P) K33.3(2:P) K39.3(2:P) K45.3(2:P) K84.7(3:O) K95.7(3:O)
N$102: K32.1(1:+) K32.3(2:P) K33.5(3:S) R16.2
N$103: K20.8(1:-) K24.8(1:-) K25.8(1:-) K32.8(1:-) K33.8(1:-) K34.8(1:-) LED13.K(C) LED14.K(C) LED15.K(C) LED16.K(C)
N$104: K33.2(2:O) K34.5(3:S)
N$105: K33.4(2:S) K34.1(1:+) K34.3(2:P) R17.2
N$106: K32.5(3:S) K33.7(3:O)
N$107: JP4.2 JP4.4 JP4.6 JP4.8 JP4.10 JP4.12 JP4.14 JP4.16 K47.5(3:S)
N$108: JP5.2 JP5.4 JP5.6 JP5.8 JP5.10 JP5.12 JP5.14 JP5.16 K48.2(2:O)
N$109: LED13.A R14.1
N$110: LED14.A R15.1
N$111: LED15.A R16.1
N$112: LED16.A R17.1
N$113: JP8.2 JP8.4 JP8.6 JP8.8 JP8.10 JP8.12 JP8.14 JP8.16 K48.5(3:S)
N$114: JP7.2 JP7.4 JP7.6 JP7.8 JP7.10 JP7.12 JP7.14 JP7.16 K48.7(3:O)
N$115: K35.1(1:+) K35.3(2:P) K36.5(3:S) R18.2
N$116: K36.2(2:O) K37.5(3:S)
N$117: K36.4(2:S) K37.1(1:+) K37.3(2:P) R19.2
N$118: K35.5(3:S) K36.7(3:O)
N$119: JP6.2 JP6.4 JP6.6 JP6.8 JP6.10 JP6.12 JP6.14 JP6.16 K48.4(2:S)
N$120: K47.6(3:P) K49.4(2:S)
N$121: K38.1(1:+) K38.3(2:P) K39.5(3:S) R20.2
N$122: K35.8(1:-) K36.8(1:-) K37.8(1:-) K38.8(1:-) K39.8(1:-) K40.8(1:-) LED17.K(C) LED18.K(C) LED19.K(C) LED20.K(C)
N$123: K39.2(2:O) K40.5(3:S)
N$124: K39.4(2:S) K40.1(1:+) K40.3(2:P) R21.2
N$125: K38.5(3:S) K39.7(3:O)
N$126: K47.3(2:P) K49.2(2:O)
N$127: K48.3(2:P) K49.7(3:O)
N$128: LED17.A R18.1
N$129: LED18.A R19.1
N$130: LED19.A R20.1
N$131: LED20.A R21.1
N$132: K48.6(3:P) K49.5(3:S)
N$133: K55.3(2:P) K73.2(2:O)
N$134: K41.1(1:+) K41.3(2:P) K42.5(3:S) R22.2
N$135: K42.2(2:O) K43.5(3:S)
N$136: K42.4(2:S) K43.1(1:+) K43.3(2:P) R23.2
N$137: K41.5(3:S) K42.7(3:O)
N$139: K63.8(1:S) K63.11(2:O) K64.3(2:P) K65.1(1:+)
N$140: K44.1(1:+) K44.3(2:P) K45.5(3:S) R24.2
N$141: K41.8(1:-) K42.8(1:-) K43.8(1:-) K44.8(1:-) K45.8(1:-) K46.8(1:-) LED21.K(C) LED22.K(C) LED23.K(C) LED24.K(C)
N$142: K45.2(2:O) K46.5(3:S)
N$143: K45.4(2:S) K46.1(1:+) K46.3(2:P) R25.2
N$144: K44.5(3:S) K45.7(3:O)
N$145: K63.4(1:P) K90.1(1:+) K90.4(2:S)
N$146: K63.6(1:O) K65.3(2:P)
N$147: LED21.A R22.1
N$148: LED22.A R23.1
N$149: LED23.A R24.1
N$150: LED24.A R25.1
N$151: K63.13(2:P) K66.9(2:S) K66.16 R28.2
N$152: K66.1 K83.3(2:P) R29.2
N$153: D5.A K64.5(3:S) K87.6(3:P)
N$154: K64.6(3:P) K66.8(1:S) K66.11(2:O) K67.1(1:+)
N$156: JP9.2 JP9.4 JP9.6 JP9.8 JP9.10 JP9.12 JP9.14 JP9.16 K50.2(2:O)
N$157: JP10.2 JP10.4 JP10.6 JP10.8 JP10.10 JP10.12 JP10.14 JP10.16 K50.4(2:S)
N$158: JP11.2 JP11.4 JP11.6 JP11.8 JP11.10 JP11.12 JP11.14 JP11.16 K50.7(3:O)
N$159: JP12.2 JP12.4 JP12.6 JP12.8 JP12.10 JP12.12 JP12.14 JP12.16 K50.5(3:S)
N$160: JP13.2 JP13.4 JP13.6 JP13.8 JP13.10 JP13.12 JP13.14 JP13.16 K51.2(2:O)
N$161: JP16.2 JP16.4 JP16.6 JP16.8 JP16.10 JP16.12 JP16.14 JP16.16 K51.5(3:S)
N$162: JP15.2 JP15.4 JP15.6 JP15.8 JP15.10 JP15.12 JP15.14 JP15.16 K51.7(3:O)
N$163: JP14.2 JP14.4 JP14.6 JP14.8 JP14.10 JP14.12 JP14.14 JP14.16 K51.4(2:S)
N$164: K50.6(3:P) K52.4(2:S)
N$165: K50.3(2:P) K52.2(2:O)
N$166: K51.3(2:P) K52.7(3:O)
N$167: K51.6(3:P) K52.5(3:S)
N$168: K49.6(3:P) K54.4(2:S)
N$169: K49.3(2:P) K54.2(2:O)
N$170: K52.3(2:P) K54.7(3:O)
N$171: K52.6(3:P) K54.5(3:S)
N$172: K53.2(2:O) K54.3(2:P)
N$173: K53.4(2:S) K54.6(3:P)
N$174: K53.3(2:P) K55.2(2:O)
N$175: JP1.15 JP2.15 JP3.15 JP4.15 JP5.15 JP6.15 JP7.15 JP8.15 JP9.15 JP10.15 JP11.15 JP12.15 JP13.15 JP14.15 JP15.15 JP16.15 JP17.1 JP18.1 JP19.1 JP20.1 JP21.1 JP22.1 JP23.1 JP24.1 JP25.1 JP26.1 JP27.1 JP28.1 JP29.1 JP30.1 JP31.1 JP32.1 K74.1(1:+) K74.4(2:S) LED25.A
N$176: K73.4(2:S)
N$177: JP1.13 JP2.13 JP3.13 JP4.13 JP5.13 JP6.13 JP7.13 JP8.13 JP9.13 JP10.13 JP11.13 JP12.13 JP13.13 JP14.13 JP15.13 JP16.13 JP17.3 JP18.3 JP19.3 JP20.3 JP21.3 JP22.3 JP23.3 JP24.3 JP25.3 JP26.3 JP27.3 JP28.3 JP29.3 JP30.3 JP31.3 JP32.3 K75.1(1:+) K75.4(2:S) LED26.A
N$178: JP17.2 JP17.4 JP17.6 JP17.8 JP17.10 JP17.12 JP17.14 JP17.16 K59.2(2:O)
N$179: JP18.2 JP18.4 JP18.6 JP18.8 JP18.10 JP18.12 JP18.14 JP18.16 K59.4(2:S)
N$180: JP19.2 JP19.4 JP19.6 JP19.8 JP19.10 JP19.12 JP19.14 JP19.16 K59.7(3:O)
N$181: JP20.2 JP20.4 JP20.6 JP20.8 JP20.10 JP20.12 JP20.14 JP20.16 K59.5(3:S)
N$182: JP21.2 JP21.4 JP21.6 JP21.8 JP21.10 JP21.12 JP21.14 JP21.16 K60.2(2:O)
N$183: JP24.2 JP24.4 JP24.6 JP24.8 JP24.10 JP24.12 JP24.14 JP24.16 K60.5(3:S)
N$184: JP23.2 JP23.4 JP23.6 JP23.8 JP23.10 JP23.12 JP23.14 JP23.16 K60.7(3:O)
N$185: JP22.2 JP22.4 JP22.6 JP22.8 JP22.10 JP22.12 JP22.14 JP22.16 K60.4(2:S)
N$186: K57.4(2:S) K59.6(3:P)
N$187: K57.2(2:O) K59.3(2:P)
N$188: K57.7(3:O) K60.3(2:P)
N$189: K57.5(3:S) K60.6(3:P)
N$190: JP1.11 JP2.11 JP3.11 JP4.11 JP5.11 JP6.11 JP7.11 JP8.11 JP9.11 JP10.11 JP11.11 JP12.11 JP13.11 JP14.11 JP15.11 JP16.11 JP17.5 JP18.5 JP19.5 JP20.5 JP21.5 JP22.5 JP23.5 JP24.5 JP25.5 JP26.5 JP27.5 JP28.5 JP29.5 JP30.5 JP31.5 JP32.5 K76.1(1:+) K76.4(2:S) LED27.A
N$192: JP1.1 JP2.1 JP3.1 JP4.1 JP5.1 JP6.1 JP7.1 JP8.1 JP9.1 JP10.1 JP11.1 JP12.1 JP13.1 JP14.1 JP15.1 JP16.1 JP17.15 JP18.15 JP19.15 JP20.15 JP21.15 JP22.15 JP23.15 JP24.15 JP25.15 JP26.15 JP27.15 JP28.15 JP29.15 JP30.15 JP31.15 JP32.15 K81.1(1:+) K81.4(2:S) LED32.A
N$193: JP1.3 JP2.3 JP3.3 JP4.3 JP5.3 JP6.3 JP7.3 JP8.3 JP9.3 JP10.3 JP11.3 JP12.3 JP13.3 JP14.3 JP15.3 JP16.3 JP17.13 JP18.13 JP19.13 JP20.13 JP21.13 JP22.13 JP23.13 JP24.13 JP25.13 JP26.13 JP27.13 JP28.13 JP29.13 JP30.13 JP31.13 JP32.13 K80.1(1:+) K80.4(2:S) LED31.A
N$196: D1.C D2.C K82.1(1:+)
N$199: JP1.9 JP2.9 JP3.9 JP4.9 JP5.9 JP6.9 JP7.9 JP8.9 JP9.9 JP10.9 JP11.9 JP12.9 JP13.9 JP14.9 JP15.9 JP16.9 JP17.7 JP18.7 JP19.7 JP20.7 JP21.7 JP22.7 JP23.7 JP24.7 JP25.7 JP26.7 JP27.7 JP28.7 JP29.7 JP30.7 JP31.7 JP32.7 K77.1(1:+) K77.4(2:S) LED28.A
N$200: JP25.2 JP25.4 JP25.6 JP25.8 JP25.10 JP25.12 JP25.14 JP25.16 K61.2(2:O)
N$201: JP26.2 JP26.4 JP26.6 JP26.8 JP26.10 JP26.12 JP26.14 JP26.16 K61.4(2:S)
N$202: JP27.2 JP27.4 JP27.6 JP27.8 JP27.10 JP27.12 JP27.14 JP27.16 K61.7(3:O)
N$203: JP28.2 JP28.4 JP28.6 JP28.8 JP28.10 JP28.12 JP28.14 JP28.16 K61.5(3:S)
N$204: JP29.2 JP29.4 JP29.6 JP29.8 JP29.10 JP29.12 JP29.14 JP29.16 K62.2(2:O)
N$205: JP32.2 JP32.4 JP32.6 JP32.8 JP32.10 JP32.12 JP32.14 JP32.16 K62.5(3:S)
N$206: JP31.2 JP31.4 JP31.6 JP31.8 JP31.10 JP31.12 JP31.14 JP31.16 K62.7(3:O)
N$207: JP30.2 JP30.4 JP30.6 JP30.8 JP30.10 JP30.12 JP30.14 JP30.16 K62.4(2:S)
N$208: K58.4(2:S) K61.6(3:P)
N$209: K58.2(2:O) K61.3(2:P)
N$210: K58.7(3:O) K62.3(2:P)
N$211: K58.5(3:S) K62.6(3:P)
N$212: K56.4(2:S) K57.6(3:P)
N$213: K56.2(2:O) K57.3(2:P)
N$214: K56.7(3:O) K58.3(2:P)
N$215: K56.5(3:S) K58.6(3:P)
N$216: K53.7(3:O) K56.3(2:P)
N$217: K53.5(3:S) K56.6(3:P)
N$218: K53.6(3:P) K55.4(2:S)
N$219: K66.4(1:P) K91.1(1:+) K91.4(2:S)
N$220: K66.6(1:O) K67.3(2:P)
N$221: K66.13(2:P) K68.9(2:S) K68.16 R30.2
N$222: K68.1 K84.6(3:P) R31.2
N$223: D4.A K69.4(2:S) K88.6(3:P)
N$224: K68.8(1:S) K68.11(2:O) K69.3(2:P) K70.1(1:+)
N$225: K68.4(1:P) K92.1(1:+) K92.4(2:S)
N$226: K68.6(1:O) K70.3(2:P)
N$227: K68.13(2:P) K71.9(2:S) K71.16 R32.2
N$228: K71.1 K84.3(2:P) R33.2
N$229: D3.A K69.5(3:S) K89.6(3:P)
N$230: K69.6(3:P) K71.8(1:S) K71.11(2:O) K72.1(1:+)
N$231: K71.13(2:P) K94.1(1:+) K94.4(2:S)
N$232: K71.4(1:P) K93.1(1:+) K93.4(2:S)
N$233: K71.6(1:O) K72.3(2:P)
N$237: K89.1(1:+) K89.4(2:S) K94.6(3:P) LED37.A
N$238: K88.1(1:+) K88.4(2:S) K93.6(3:P) LED36.A
N$240: LED25.K(C) R34.2
N$242: LED26.K(C) R35.2
N$243: LED27.K(C) R36.2
N$244: LED28.K(C) R37.2
N$245: JP1.7 JP2.7 JP3.7 JP4.7 JP5.7 JP6.7 JP7.7 JP8.7 JP9.7 JP10.7 JP11.7 JP12.7 JP13.7 JP14.7 JP15.7 JP16.7 JP17.9 JP18.9 JP19.9 JP20.9 JP21.9 JP22.9 JP23.9 JP24.9 JP25.9 JP26.9 JP27.9 JP28.9 JP29.9 JP30.9 JP31.9 JP32.9 K78.1(1:+) K78.4(2:S) LED29.A
N$246: JP1.5 JP2.5 JP3.5 JP4.5 JP5.5 JP6.5 JP7.5 JP8.5 JP9.5 JP10.5 JP11.5 JP12.5 JP13.5 JP14.5 JP15.5 JP16.5 JP17.11 JP18.11 JP19.11 JP20.11 JP21.11 JP22.11 JP23.11 JP24.11 JP25.11 JP26.11 JP27.11 JP28.11 JP29.11 JP30.11 JP31.11 JP32.11 K79.1(1:+) K79.4(2:S) LED30.A
N$247: LED29.K(C) R38.2
N$248: LED30.K(C) R39.2
N$249: LED31.K(C) R40.2
N$250: LED32.K(C) R41.2
N$253: K87.1(1:+) K87.4(2:S) K92.6(3:P) LED35.A
N$256: LED33.K(C) R42.2
N$257: LED34.K(C) R43.2
N$258: LED35.K(C) R44.2
N$259: LED36.K(C) R45.2
N$260: LED37.K(C) R46.2
N$261: K85.1(1:+) K85.4(2:S) K90.6(3:P) LED33.A
OPERATION: D34.A D50.A K64.1(1:+) K69.1(1:+)
RAMRD/WR-: D46.C D47.C D48.C D49.C D50.C K21.3(2:P) K95.1(1:+) K96.1(1:+)
VCC: C2.+ C3.+ C4.+ C5.+ K65.2(2:O) K67.2(2:O) K70.2(2:O) K72.2(2:O) K73.3(2:P) K74.5(3:S) K75.5(3:S) K76.5(3:S) K77.5(3:S) K78.5(3:S) K79.5(3:S) K80.5(3:S) K81.5(3:S) K82.2(2:O) K85.5(3:S) K86.5(3:S) K87.5(3:S) K88.5(3:S) K89.5(3:S) K90.5(3:S) K91.5(3:S) K92.5(3:S) K93.5(3:S) K94.5(3:S) K97.2(2:O) K98.2(2:O) K99.2(2:O) K100.2(2:O) X1.2
ZERO: D3.C D4.C D5.C D6.C D45.A
Unconnected: K1.2(2:O) K1.7(3:O) K3.2(2:O) K3.7(3:O) K4.2(2:O) K4.3(2:P) K4.4(2:S) K4.5(3:S) K4.6(3:P) K4.7(3:O) K6.2(2:O) K6.7(3:O) K8.2(2:O) K8.7(3:O) K10.2(2:O) K10.7(3:O) K12.2(2:O) K12.7(3:O) K16.2(2:O) K16.7(3:O) K18.2(2:O) K18.3(2:P) K18.4(2:S) K18.7(3:O) K20.2(2:O) K20.7(3:O) K25.2(2:O) K25.7(3:O) K26.2(2:O) K26.7(3:O) K28.2(2:O) K28.7(3:O) K29.2(2:O) K29.7(3:O) K31.2(2:O) K31.7(3:O) K32.2(2:O) K32.7(3:O) K34.2(2:O) K34.7(3:O) K35.2(2:O) K35.7(3:O) K37.2(2:O) K37.7(3:O) K38.2(2:O) K38.7(3:O) K40.2(2:O) K40.7(3:O) K41.2(2:O) K41.7(3:O) K43.2(2:O) K43.7(3:O) K44.2(2:O) K44.7(3:O) K46.2(2:O) K46.7(3:O) K55.5(3:S) K55.6(3:P) K55.7(3:O) K65.5(3:S) K65.6(3:P) K65.7(3:O) K67.5(3:S) K67.6(3:P) K67.7(3:O) K70.5(3:S) K70.6(3:P) K70.7(3:O) K72.5(3:S) K72.6(3:P) K72.7(3:O) K73.5(3:S) K73.6(3:P) K73.7(3:O) K74.2(2:O) K75.2(2:O) K76.2(2:O) K77.2(2:O) K78.2(2:O) K79.2(2:O) K80.2(2:O) K81.2(2:O) K82.5(3:S) K82.6(3:P) K82.7(3:O) K85.2(2:O) K86.2(2:O) K87.2(2:O) K88.2(2:O) K89.2(2:O) K90.2(2:O) K91.2(2:O) K92.2(2:O) K93.2(2:O) K94.2(2:O) K95.4(2:S) K95.5(3:S) K96.4(2:S) K96.5(3:S) K97.5(3:S) K97.6(3:P) K97.7(3:O) K98.5(3:S) K98.6(3:P) K98.7(3:O) K99.5(3:S) K99.6(3:P) K99.7(3:O) K100.5(3:S) K100.6(3:P) K100.7(3:O)

## Notes on the sheet
- Q0/D0-
- Q1/D1
- LATCH RESULT
- Q0/D0-
- Q1/D1
- Ao..A3 | B0..B3 | O0..O3
- VCC
- CIN
- A/B-
- ZERO | COUT
- Q0/D0-
- INSTR4 | INSTR5 | INSTR6 | INSTR7 | LATCH A | OPERATION
- Q1/D1
- VCC
- VCC
- LATCH_INSTR | LATCH_INSTR
- Q0/D0-
- RAMRD/WR-
- RAM: decoder per 4 celle
- VCC
- Q1/D1
- A0
- Expansion
- RD/WR
- A1
- OutEnable
- RAMRD/WR-
- RD/WR
- VCC
- GND
- OutEnable
- OE
- OutEnable
- RD/WR
- D0
- D1
- OutEnable
- RD/WR
- D2
- OutEnable | D3
- D4
- GND
- OE
- LATCH_PC- | D0..D5
- Q0..Q5
- HCF-
- CLK1
- CK_COUNTERS
- D0
- D1
- D2
- CLK2
- D3
- 2 phase clock generator | GND | GND
- 6 bit latch counter
- D4..D7
- A7-
- A6-
- CLK1-
- CLK2-

## Library data of the parts
C1-C5 = rcl:CPOL-EU: POLARIZED CAPACITOR, European symbol
D1-D6 D29-D50 = diode:1N4004: DIODE general purpose rectifier, 1 A
JP1-JP32 = jumper:JP8Q: JUMPER
K1-K62 K64 K65 K67 K69 K70 K72-K100 = relay:G6J*-2?-Y: Surface-Mounting Signal Relay - G6J-Y 5.7 x 10.6 x 9 mm Source: http://www.omroncomponents.eu/ .. K125-E2-02-X.pdf; MF: OMRON COMPONENTS USA; MPN: G6J-2P-Y-DC12; OC_FARNELL: unknown; OC_NEWARK: 70J9830
K63 K66 K68 K71 = relay:G5V-2: OMRON PCB Relay Source: http://www.omron.com/ecb/products/pdf/en-g5v2.pdf; MPN: G5V-2 5DC; OC_FARNELL: 9949488; OC_NEWARK: 78K5703
LED1-LED37 = led:LED: LED OSRAM: - CHIPLED LG R971, LG N971, LY N971, LG Q971, LY Q971, LO R971, LY R971 LH N974, LH R974 LS Q976, LO Q976, LY Q976 LO Q996 - Hyper CHIPLED LW Q18S LB Q993, LB Q99A, LB R99A - SideLED LS A670, LO A670, LY A670, LG A670, LP A670 LB A673, LV A673, LT A673, LW A673 LH A674 LY A675 LS A676, LA A676, LO A676, LY A676, LW A676 LS A679, LY A679, LG A679 - Hyper Micro SIDELED® LS Y876, LA Y876, LO Y876, LY Y876 LT Y87S - SmartLED LW L88C, LW L88S LB L89C, LB L89S, LG L890 LS L89K, LO L89K, LY L89K LS L896, LA L896, LO L896, LY L896 - TOPLED LS T670, LO T670, LY T670, LG T670, LP T670 LSG T670, LSP T670, LSY T670, LOP T670, LYG T670 LG T671, LOG T671, LSG T671 LB T673, LV T673, LT T673, LW T673 LH T674 LS T676, LA T676, LO T676, LY T676, LB T676, LH T676, LSB T676, LW T676 LB T67C, LV T67C, LT T67C, LS T67K, LO T67K, LY T67K, LW E67C LS E67B, LA E67B, LO E67B, LY E67B, LB E67C, LV E67C, LT E67C LW T67C LS T679, LY T679, LG T679 LS T770, LO T770, LY T770, LG T770, LP T770 LB T773, LV T773, LT T773, LW T773 LH T774 LS E675, LA E675, LY E675, LS T675 LS T776, LA T776, LO T776, LY T776, LB T776 LHGB T686 LT T68C, LB T68C - Hyper Mini TOPLED® LB M676 - Mini TOPLED Santana® LG M470 LS M47K, LO M47K, LY M47K Source: http://www.osram.convergy.de LUXEON: - LUMILED® LXK2-PW12-R00, LXK2-PW12-S00, LXK2-PW14-U00, LXK2-PW14-V00 LXK2-PM12-R00, LXK2-PM12-S00, LXK2-PM14-U00 LXK2-PE12-Q00, LXK2-PE12-R00, LXK2-PE12-S00, LXK2-PE14-T00, LXK2-PE14-U00 LXK2-PB12-K00, LXK2-PB12-L00, LXK2-PB12-M00, LXK2-PB14-N00, LXK2-PB14-P00, LXK2-PB14-Q00 LXK2-PR12-L00, LXK2-PR12-M00, LXK2-PR14-Q00, LXK2-PR14-R00 LXK2-PD12-Q00, LXK2-PD12-R00, LXK2-PD12-S00 LXK2-PH12-R00, LXK2-PH12-S00 LXK2-PL12-P00, LXK2-PL12-Q00, LXK2-PL12-R00 Source: www.luxeon.com KINGBRIGHT: KA-3528ASYC Source: www.kingbright.com
R1-R46 = rcl:R-EU_: RESISTOR, European symbol
X1 = con-phoenix-350:1751248: MKDS 1/ 2-3,5 Printklemme Nennstrom: 10 A Bemessungsspannung: 160 V Raster: 3,5 mm Polzahl: 2 Montageart: Löten Anschlussart: Schraubanschluss Anschlussrichtung vom Leiter zur Platine: 0° Source: http://eshop.phoenixcontact.com .. 1751248.pdf; OC_FARNELL: unknown; OC_NEWARK: unknown